# Altium project PCB_Project.PrjPcb
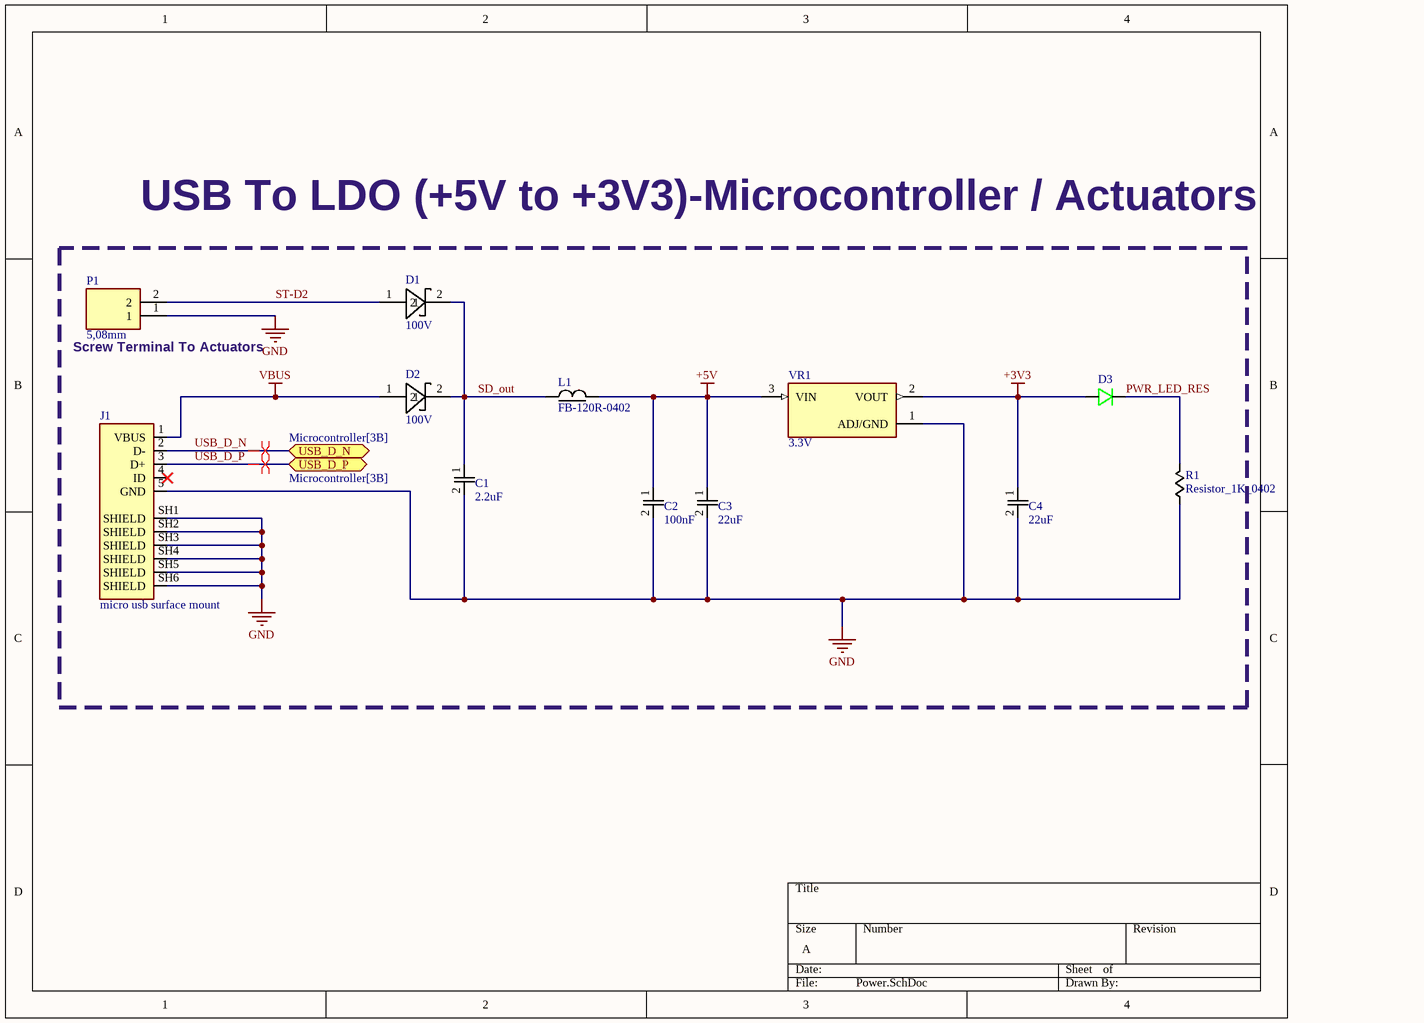
[diagram p0: Power.SchDoc]
4 sheets, 51 parts. Net scope: flat (ports and power ports of the same name join across sheets).
Board file: PCB1.PcbDoc
Sheets:
  Power.SchDoc
  Microcontroller.SchDoc
  Sensors.SchDoc
  Actuators.SchDoc

## Sheet Power.SchDoc
size A; SheetNumber: 1; SheetTotal: 4

### Parts
C1  2.2uF  [CAPC1005X55N]
C2  100nF  [CAPC1005X55N]
C3  22uF  [CAPC1005X55N]
C4  22uF  [CAPC1005X55N]
D1  100V  [Schottky.D]
D2  100V  [Schottky.D]
D3  Green LED 0805  [LED_APT2012MGC]  (value not drawn)
J1  micro usb surface mount  [TE_1981568-1]
L1  FB-120R-0402  [RESC1005X40N]
P1  5,08mm  [Screw_terminal_block_5.0]
R1  Resistor_1K_0402  [RESC1005X40N]
VR1  3.3V  [SOT229P700X180-4N]

### Blocks framed on the sheet
Screw Terminal To Actuators: C1-C4 D1-D3 J1 L1 P1 R1 VR1

### Ports
USB_D_N (bidir, see Microcontroller[3B]), USB_D_P (bidir, see Microcontroller[3B])

### Nets
+3V3: C4.1 D3.A VR1.2(VOUT)
+5V: C2.1 C3.1 L1.2 VR1.3(VIN)
GND: C1.2 C2.2 C3.2 C4.2 J1.5(GND) J1.SH1(SHIELD) J1.SH2(SHIELD) J1.SH3(SHIELD) J1.SH4(SHIELD) J1.SH5(SHIELD) J1.SH6(SHIELD) P1.1 R1.1 VR1.1(ADJ/GND)
VBUS: D2.1 J1.1(VBUS)
PWR_LED_RES: D3.C R1.2
SD_out: C1.1 D1.2 D2.2 L1.1
ST-D2: D1.1 P1.2
USB_D_N: J1.2(D-) ; port USB_D_N
USB_D_P: J1.3(D+) ; port USB_D_P

Not connected (* = marked no-connect by the designer): J1 4(ID)*

### Layout directives
differential pair: USB_D_N, USB_D_P

### Notes on the sheet
- USB To LDO (+5V to +3V3)-Microcontroller / Actuators

### Library data of the parts
C1 = Cap_2.2uF_0402: CAP CER 2.2uF 16V X5R 0402; Manufacturer: Samsung Electro-Mechanics; Manufacturer Part #: CL05A225KO5NQNC; Supplier: LCSC; Supplier Part#: C170151; ComponentLink1Description: Data Sheet; ComponentLink1URL: https://www.lcsc.com/datasheet/C170151.pdf?spm=wm.sxq.inf.ggs___wm.fly.bg.3.stp&lcsc_vid=T1MKV1cAE1gLBAVfTgIKUgJfTlkPBQBVQlMMBAJURwAxVlNeT1dfVlxVQ1ReXzsOAxUeFF5JWBYZEEoKFBINSQcJGk4%3D
C2 = Cap_100nF_0402: CAP CER 100nF 16V X7R 0402; Manufacturer: Samsung Electro-Mechanics; Manufacturer Part #: CL05B104KO5NNNC; Supplier: LCSC; Supplier Part#: C1525; ComponentLink1Description: Data Sheet; ComponentLink1URL: https://www.lcsc.com/datasheet/C1525.pdf?spm=wm.sxq.inf.ggs___wm.fly.bg.1.stp&lcsc_vid=T1MKV1cAE1gLBAVfTgIKUgJfTlkPBQBVQlMMBAJURwAxVlNeT1dfVlxVQ1ReXzsOAxUeFF5JWBYZEEoKFBINSQcJGk4%3D
C3 C4 = Cap_22uF_0402: CAP CER 22uF 6.3V X5R 0402; Manufacturer: Samsung Electro-Mechanics; Manufacturer Part #: CL05A226MQ5QUNC; Supplier: LCSC; Supplier Part#: C105226; ComponentLink1Description: Data Sheet; ComponentLink1URL: https://www.lcsc.com/datasheet/C105226.pdf?spm=wm.sxq.inf.ggs___wm.fly.bg.3.stp&lcsc_vid=T1MKV1cAE1gLBAVfTgIKUgJfTlkPBQBVQlMMBAJURwAxVlNeT1dfVlxVQ1ReXzsOAxUeFF5JWBYZEEoKFBINSQcJGk4%3D
D1 D2 = Schottky_D: 100V 850mV@5A 5A SMAG Schottky Diodes ROHS; Manufacturer: Nexperia; Mfr. Part #: BAT54S,215; Splr.part#: C466506; Supplier: LCSC; ComponentLink1Description: New link; ComponentLink1URL: https://www.lcsc.com/product-detail/C466506.html?s_z=n_schottky%2520diode
D3 = Green LED 0805: LED GREEN 0805 SMD; Manufacturer: NATIONSTAR; Manufacturer Part#: NCD0805G1; Supplier: LCSC; Supplier Part#: C84260; ComponentLink1Description: Data Sheet; ComponentLink1URL: https://www.lcsc.com/datasheet/C84260.pdf?spm=wm.sxq.inf.ggs___wm.fly.bg.0.stp&lcsc_vid=FVIKU1JeEVJYVVVSQVdZUQJSQlYKVAJXRwQLV1VXQlYxVlNeQVdfUV1TQ1ReXzsOAxUeFF5JWBYZEEoKFBINSQcJGk4NBhADEA4cHktXRlVcSQwSGg0%3D
J1 = micro usb surface mount: MICRO USB, TYPE B,; Manufacturer: HMTCONN; Manufacturer Part#: HMT-MICRO USB 4P; Supplier: LCSC; Supplier Part#: C53121381; ComponentLink1Description: Data Sheet; ComponentLink1URL: https://www.lcsc.com/datasheet/C53121381.pdf?spm=wm.sxq.inf.ggs___wm.ssy.bg.2.stp&lcsc_vid=RlgPBF0EEVEPX1ZVRAVZVwcHRVJaBVJSTlNXAgBWFlkxVlNeQFFbX1NTQ1dfVzsOAxUeFF5JWBYZEEoKFBINSQcJGk4eFQsCAgIaSgADAwAHC0slT1VdUFJIHxUDCw%3D%3D
L1 = FB-120R-0402: FERRITE BEAD 120Ω 0402; Manufacturer: KOHERelec; Manufacturer Part#: FBHA0402-121-202R; Supplier: LCSC; Supplier Part#: C41355350; ComponentLink1Description: Data Sheet; ComponentLink1URL: https://www.lcsc.com/datasheet/C41355350.pdf?spm=wm.sxq.inf.ggs___wm.fly.bg.5.stp&lcsc_vid=T1MKV1cAE1gLBAVfTgIKUgJfTlkPBQBVQlMMBAJURwAxVlNeT1dcVldXR1JYUjsOAxUeFF5JWBYZEEoKFBINSQcJGk4NBhADEA4cHktXRlZeSQwSGg0%3D
P1 = screw terminal block 2 port: 1x2P 18A -40℃~+105℃ 250V Green 14~30 Through Hole 5.08mm 2.5 1 2 Through Hole,P=5.08mm Screw Terminal Blocks ROHS; Manufacturer: KANGNEX; Mfr. Part #: WJ500V-5.08-2P; Splr.part#: C8465; Supplier: LCSC; ComponentLink1Description: New link; ComponentLink1URL: https://www.lcsc.com/product-detail/C8465.html
R1 = Resistor_1K_0402: 1kOhms Â±1% 0.063W, 1/16W Chip Resistor 0402 (1005 Metric) Moisture Resistant Thick Film; Manufacturer: FOJAN; Manufacturer Part #: RC0402FR-071KL; Supplier: LCSC; Supplier Part #: C106235; ComponentLink1Description: Data Sheet; ComponentLink1URL: https://www.lcsc.com/datasheet/C106235.pdf?spm=wm.sxq.inf.ggs___wm.fly.bg.2.stp&lcsc_vid=T1MKV1cAE1gLBAVfTgIKUgJfTlkPBQBVQlMMBAJURwAxVlNeT1dcVlJVRFlZVzsOAxUeFF5JWBYZEEoKFBINSQcJGk4NBhADEA4cHktXRlhXSQwSGg0%3D
VR1 = AMS1117_3.3: 72dB@(120Hz) 1A Fixed 3.3V Positive 16V SOT-223 Voltage Regulators - Linear, Low Drop Out (LDO) Regulators ROHS; Manufacturer: Advanced Monolithic Systems; Mfr. Part #: AMS1117-3.3; Splr.part#: C6186; Supplier: LCSC; ComponentLink1Description: New link; ComponentLink1URL: https://www.lcsc.com/product-detail/C6186.html?s_z=n_ASM1117

## Sheet Microcontroller.SchDoc
size 420 x 297 mm; SheetNumber: 2; SheetTotal: 4
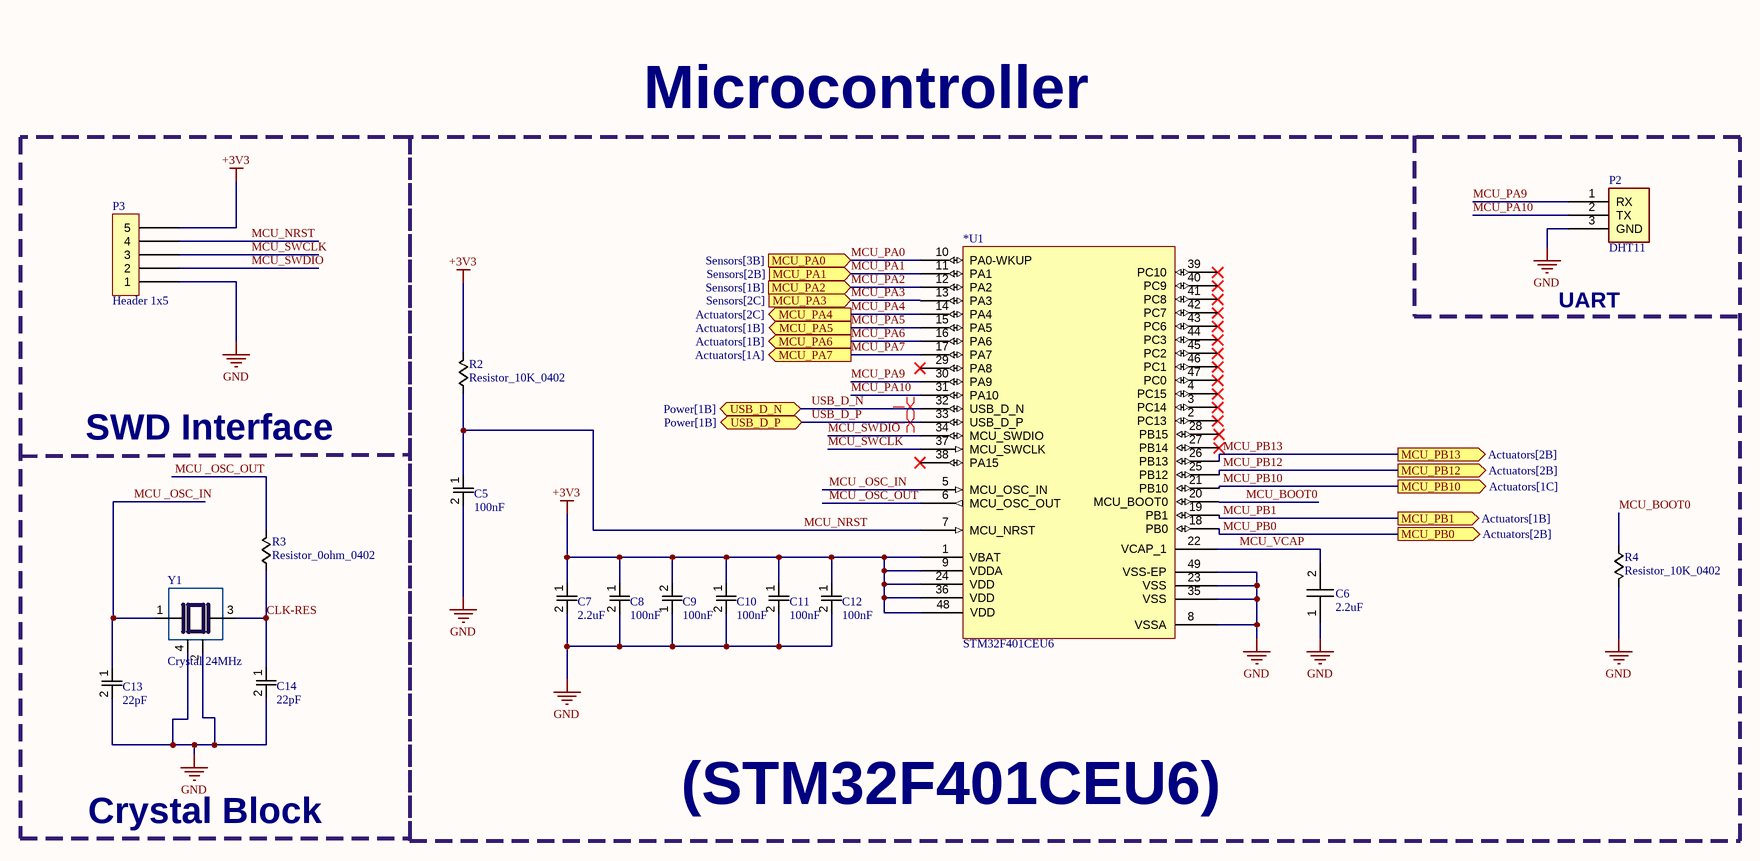
[diagram p1: Microcontroller.SchDoc]

### Parts
*U1  STM32F401CEU6  [UFQFPN-48_7x7mm_P0.5mm]
C5  100nF  [CAPC1005X55N]
C6  2.2uF  [CAPC2012X140N]
C7  2.2uF  [CAPC1005X55N]
C8  100nF  [CAPC1005X55N]
C9  100nF  [CAPC1005X55N]
C10  100nF  [CAPC1005X55N]
C11  100nF  [CAPC1005X55N]
C12  100nF  [CAPC1005X55N]
C13  22pF  [CAPC1005X55N]
C14  22pF  [CAPC1005X55N]
P2  DHT11  [HEADER 1x3 MALE]
P3  Header 1x5  [Header 1x5 male]
R2  Resistor_10K_0402  [RESC1005X40N]
R3  Resistor_0ohm_0402  [RESC1005X40N]
R4  Resistor_10K_0402  [RESC1005X40N]
Y1  Crystal 24MHz  [XTAL_C7S-24.000-12-3030-X-R]

### Blocks framed on the sheet
(STM32F401CEU6): *U1 C5-C12 P2 R2 R4

### Ports
MCU_PA0 (in, see Sensors[3B]), MCU_PA1 (in, see Sensors[2B]), MCU_PA2 (in, see Sensors[1B]), MCU_PA3 (in, see Sensors[2C]), MCU_PA4 (out, see Actuators[2C]), MCU_PA5 (out, see Actuators[1B]), MCU_PA6 (out, see Actuators[1B]), MCU_PA7 (out, see Actuators[1A]), MCU_PB0 (out, see Actuators[2B]), MCU_PB1 (out, see Actuators[1B]), MCU_PB10 (out, see Actuators[1C]), MCU_PB12 (out, see Actuators[2B]), MCU_PB13 (out, see Actuators[2B]), USB_D_N (bidir, see Power[1B]), USB_D_P (bidir, see Power[1B])

### Nets
+3V3: *U1.1(VBAT) *U1.9(VDDA) *U1.24(VDD) *U1.36(VDD) *U1.48(VDD) C7.1 C8.1 C9.2 C10.1 C11.1 C12.1 P3.5 R2.2
GND: *U1.8(VSSA) *U1.23(VSS) *U1.35(VSS) *U1.49(VSS-EP) C5.2 C6.1 C7.2 C8.2 C9.1 C10.2 C11.2 C12.2 C13.2 C14.2 P2.3(GND) P3.1 R4.2 Y1.2 Y1.4
CLK-RES: C14.1 R3.1 Y1.3
MCU _OSC_IN: *U1.5(MCU_OSC_IN) C13.1 Y1.1
MCU _OSC_OUT: *U1.6(MCU_OSC_OUT) R3.2
MCU_BOOT0: *U1.20(MCU_BOOT0) R4.1
MCU_NRST: *U1.7(MCU_NRST) C5.1 P3.4 R2.1
MCU_PA0: *U1.10(PA0-WKUP) ; port MCU_PA0
MCU_PA1: *U1.11(PA1) ; port MCU_PA1
MCU_PA2: *U1.12(PA2) ; port MCU_PA2
MCU_PA3: *U1.13(PA3) ; port MCU_PA3
MCU_PA4: *U1.14(PA4) ; port MCU_PA4
MCU_PA5: *U1.15(PA5) ; port MCU_PA5
MCU_PA6: *U1.16(PA6) ; port MCU_PA6
MCU_PA7: *U1.17(PA7) ; port MCU_PA7
MCU_PA9: *U1.30(PA9) P2.1(RX)
MCU_PA10: *U1.31(PA10) P2.2(TX)
MCU_PB0: *U1.18(PB0) ; port MCU_PB0
MCU_PB1: *U1.19(PB1) ; port MCU_PB1
MCU_PB10: *U1.21(PB10) ; port MCU_PB10
MCU_PB12: *U1.25(PB12) ; port MCU_PB12
MCU_PB13: *U1.26(PB13) ; port MCU_PB13
MCU_SWCLK: *U1.37(MCU_SWCLK) P3.3
MCU_SWDIO: *U1.34(MCU_SWDIO) P3.2
MCU_VCAP: *U1.22(VCAP_1) C6.2
USB_D_N: *U1.32(USB_D_N) ; port USB_D_N
USB_D_P: *U1.33(USB_D_P) ; port USB_D_P

Not connected (* = marked no-connect by the designer): *U1 2(PC13)* 3(PC14)* 4(PC15)* 27(PB14)* 28(PB15)* 29(PA8)* 38(PA15)* 39(PC10)* 40(PC9)* 41(PC8)* 42(PC7)* 43(PC6)* 44(PC3)* 45(PC2)* 46(PC1)* 47(PC0)*

### Layout directives
differential pair: (no net found under the mark), USB_D_P

### Notes on the sheet
- Microcontroller
- UART
- SWD Interface
- Crystal Block
- THIS DOCUMENT AND THE DATA DISCLOSED HEREIN OR
- HEREWITH IS THE PROPERTY OF ALTIUM LIMITED AND MAY
- DWG NO:
- REVISION
- REV:
- DESCRIPTION
- DATE
- APPROVED
- BE FREELY DISTRIBUTED IN WHOLE. NO RIGHTS ARE
- RESERVED OR EXPRESS OR IMPLIED WARANTEE GIVEN.
- ENG:
- APPROVALS
- PROJECT
- DSN:
- CHK:
- REFERENCE DOCUMENTS
- PROJECT REVISION:
- TITLE
- DOCUMENT REVISION:
- DESIGN ITEM:
- BOM:
- FAB DWG:
- PCB DWG:
- ASSY DWG:
- SCALE:
- A3
- SIZE
- CAGE CODE
- FILE NAME
- DWG NO.
- SHEET
- OF
- REV

### Library data of the parts
*U1 = STM32F401CEU6: ARM Cortex-M4 32b MCU+FPU,105DMIPS,512KB Flash/96KB RAM, 11 TIMs, 1 ADC, 11 comm. interfaces; Manufacturer: ST; Manufacturer Part#: STM32F401CEU6; Supplier: LCSC; Supplier Part#: C60420; ComponentLink1Description: Data Sheet; ComponentLink1URL: https://www.lcsc.com/datasheet/C60420.pdf?spm=wm.sxq.inf.ggs___wm.fly.bg.0.stp&lcsc_vid=E1QPAlFSFlQNAwEAEQJdBlJfE1hWVlFUQlIPUgAERAIxVlNeQFNcV1NSTlNaUDsOAxUeFF5JWBYZEEoKFBINSQcJGk4%3D
C5 C8-C12 = Cap_100nF_0402: as C2 on sheet Power; Supplier: LCSC; Supplier Part#: C1525; ComponentLink1Description: Data Sheet; ComponentLink1URL: https://www.lcsc.com/datasheet/C1525.pdf?spm=wm.sxq.inf.ggs___wm.fly.bg.1.stp&lcsc_vid=T1MKV1cAE1gLBAVfTgIKUgJfTlkPBQBVQlMMBAJURwAxVlNeT1dfVlxVQ1ReXzsOAxUeFF5JWBYZEEoKFBINSQcJGk4%3D
C6 = Cap_0805_2u2F: CAP CER 2.2uF 16V X7R 0805; Manufacturer: Samsung Electro-Mechanics; Manufacturer Part#: CL21B225KOFNNNE; Supplier: LCSC; Supplier Part#: C28234; ComponentLink1Description: Data Sheet; ComponentLink1URL: https://www.lcsc.com/datasheet/C28234.pdf?spm=wm.sxq.inf.ggs___wm.fly.bg.7.stp&lcsc_vid=RlgPBF0EEVEPX1ZVRAVZVwcHRVJaBVJSTlNXAgBWFlkxVlNeQFFbX1RVRFRaVTsOAxUeFF5JWBYZEEoBGA4JCwFIFA4DSA%3D%3D
C7 = Cap_2.2uF_0402: as C1 on sheet Power; Supplier: LCSC; Supplier Part#: C170151; ComponentLink1Description: Data Sheet; ComponentLink1URL: https://www.lcsc.com/datasheet/C170151.pdf?spm=wm.sxq.inf.ggs___wm.fly.bg.3.stp&lcsc_vid=T1MKV1cAE1gLBAVfTgIKUgJfTlkPBQBVQlMMBAJURwAxVlNeT1dfVlxVQ1ReXzsOAxUeFF5JWBYZEEoKFBINSQcJGk4%3D
C13 C14 = Cap_22pF_0402: CAP CER 22pF 50V NP0 0402; Manufacturer: YAGEO; Manufacturer Part #: CC0402JRNPO9BN220; Supplier: LCSC; Supplier Part#: C106203; ComponentLink1Description: Data Sheet; ComponentLink1URL: https://www.lcsc.com/datasheet/C106203.pdf?spm=wm.sxq.inf.ggs___wm.fly.bg.0.stp&lcsc_vid=RFgKVFNTRgJeV1xfTlldBAVTQANbU1dQTgBXBVEDElgxVlNeT1ZZU1VQQ1ZZXztW
P2 = UART: ComponentLink1Description: Link
R2 R4 = Resistor_10K_0402: RES 10kΩ ±1% 62.5mW 0402; Manufacturer: YAGEO; Manufacturer Part #: RC0402FR-0710KL; Supplier: LCSC; Supplier Part #: C60490; ComponentLink1Description: Data Sheet; ComponentLink1URL: https://www.lcsc.com/datasheet/C60490.pdf?spm=wm.sxq.inf.ggs___wm.fly.bg.1.stp&lcsc_vid=T1MKV1cAE1gLBAVfTgIKUgJfTlkPBQBVQlMMBAJURwAxVlNeT1dcVVBSRVlfUDsOAxUeFF5JWBYZEEoKFBINSQcJGk4NBhADEA4cHktXRlhXSQwSGg0%3D
R3 = Resistor_0ohm_0402: RES 0Ω 0.1W 0402; Manufacturer: PANASONIC; Manufacturer Part #: ERJ2GE0R00X; Supplier: LCSC; Supplier Part #: C242160; ComponentLink1Description: Data Sheet; ComponentLink1URL: https://www.lcsc.com/datasheet/C242160.pdf?spm=wm.sxq.inf.ggs___wm.fly.bg.1.stp&lcsc_vid=T1MKV1cAE1gLBAVfTgIKUgJfTlkPBQBVQlMMBAJURwAxVlNeT1dcVF1TR1RYVzsOAxUeFF5JWBYZEEoKFBINSQcJGk4NBhADEA4cHktXRlhXSQwSGg0%3D
Y1 = Crystal 24MHz: YXC Crystal Oscillators XL7EL89CKI-111YLC-24M; Manufacturer Part#: SMD2016-4P; Manufacturer: YXC Crystal Oscillators; Supplier: LCSC; Supplier Part#: C2965580; ComponentLink1Description: Data Sheet; ComponentLink1URL: https://www.lcsc.com/datasheet/C2965580.pdf?spm=wm.sxq.inf.ggs___wm.fly.bg.0.stp&lcsc_vid=EVYPBVRQTlZbUwYCRFgKAVAHE1INAl1VRwJdBFRRElcxVlNeQFNdUFxSTldXXjsOAxUeFF5JWBYZEEoKFBINSQcJGk4dAgUUFAk%3D

## Sheet Sensors.SchDoc
size A; SheetNumber: 3; SheetTotal: 4
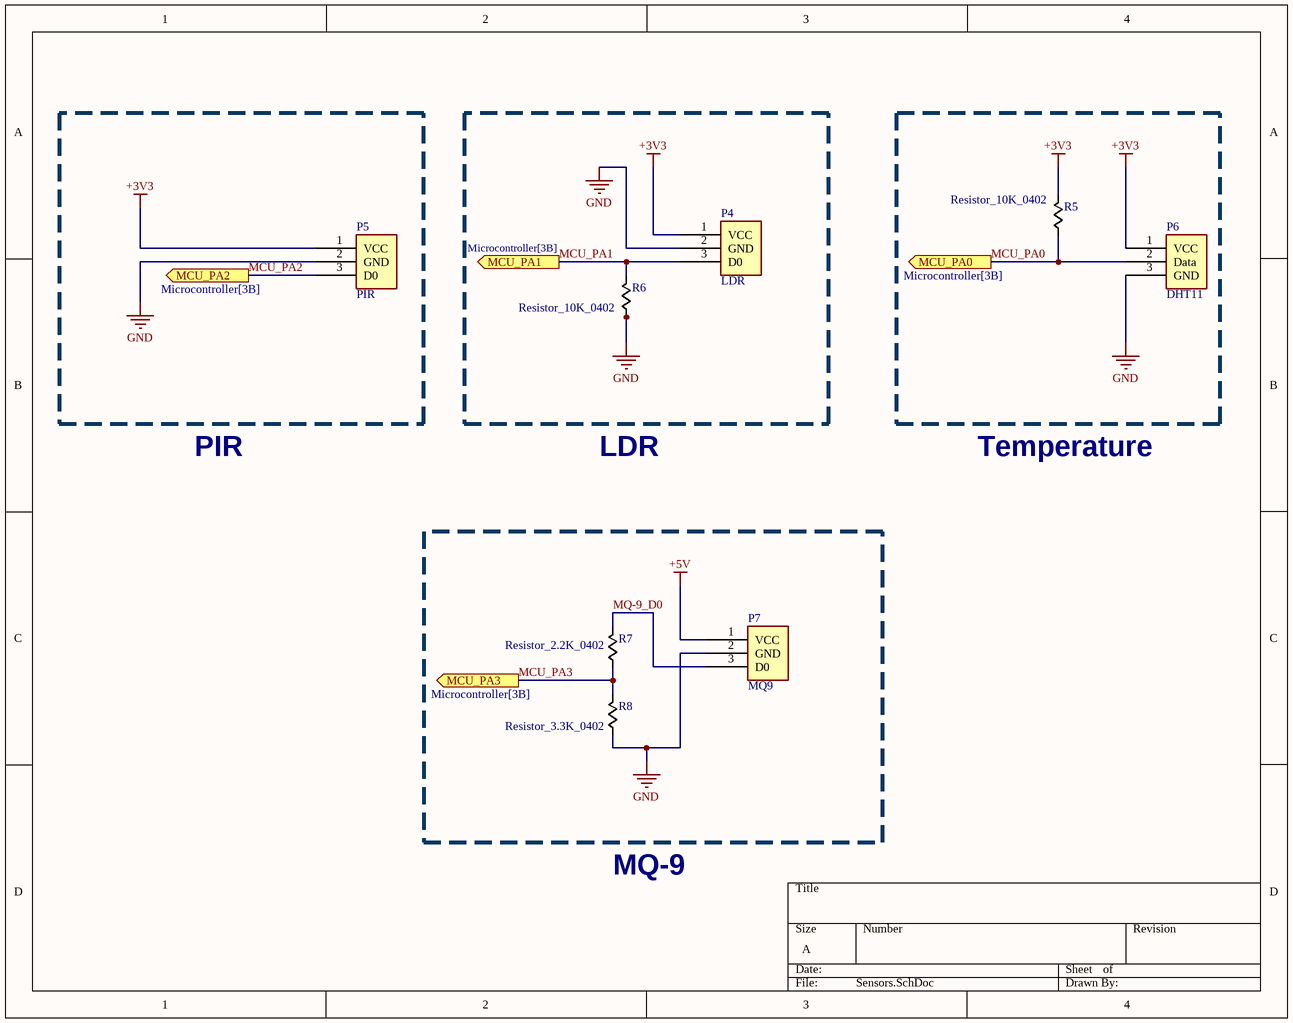
[diagram p2: Sensors.SchDoc]

### Parts
P4  LDR  [HEADER 1x3 MALE]
P5  PIR  [HEADER 1x3 MALE]
P6  DHT11  [HEADER 1x3 MALE]
P7  MQ9  [HEADER 1x3 MALE]
R5  Resistor_10K_0402  [RESC1005X40N]
R6  Resistor_10K_0402  [RESC1005X40N]
R7  Resistor_2.2K_0402  [RESC1005X40N]
R8  Resistor_3.3K_0402  [RESC1005X40N]

### Ports
MCU_PA0 (out, see Microcontroller[3B]), MCU_PA1 (out, see Microcontroller[3B]), MCU_PA2 (out, see Microcontroller[3B]), MCU_PA3 (out, see Microcontroller[3B])

### Nets
+3V3: P4.1(VCC) P5.1(VCC) P6.1(VCC) R5.2
+5V: P7.1(VCC)
GND: P4.2(GND) P5.2(GND) P6.3(GND) P7.2(GND) R6.1 R8.1
MCU_PA0: P6.2(Data) R5.1 ; port MCU_PA0
MCU_PA1: P4.3(D0) R6.2 ; port MCU_PA1
MCU_PA2: P5.3(D0) ; port MCU_PA2
MCU_PA3: R7.1 R8.2 ; port MCU_PA3
MQ-9_D0: P7.3(D0) R7.2

### Notes on the sheet
- PIR
- LDR
- Temperature
- MQ-9

### Library data of the parts
P4 = Header 1x3-LDR: The LDR Light Sensor Module detects light intensity, with resistance decreasing as light increases. Ideal for automatic lighting and brightness sensing.; Supplier: Makers Electronics; Supplier Part#: 300000009413; ComponentLink1Description: Link; ComponentLink1URL: https://makerselectronics.com/product/ldr-light-sensor-module/
P5 = Header 1x3-PIR: AM312  is a compact PIR motion sensor (HW-740) that detects motion up to 5 m with ultra-low power consumption for battery-powered projects.automatic lighting and brightness sensing.; Supplier: Makers Electronics; Supplier Part#: 3496300110674; ComponentLink1Description: Link; ComponentLink1URL: https://makerselectronics.com/product/am312-mini-pir-motion-sensor-module/
P6 = Header 1x3-DHT Temp: DHT11 Temperature Humidity Sensor Board measures temperature (0–50°C) and humidity (20–90%) with digital output, ideal for weather monitoring, IoT, automation.; Supplier: Makers Electronics; Supplier Part#: 300000009298; ComponentLink1Description: Link; ComponentLink1URL: https://makerselectronics.com/product/dht11-board/
P7 = Header 1x3-MQ9: MQ-9 is a compact and versatile gas sensor module for detecting carbon monoxide and combustible gases.; Supplier: Makers Electronics; Supplier Part#: 300000009267; ComponentLink1Description: Link; ComponentLink1URL: https://makerselectronics.com/product/mq-9-carbon-monoxide-gas-sensor/
R5 R6 = Resistor_10K_0402: as R2 on sheet Microcontroller; Supplier: LCSC; Supplier Part #: C60490; ComponentLink1Description: Data Sheet; ComponentLink1URL: https://www.lcsc.com/datasheet/C60490.pdf?spm=wm.sxq.inf.ggs___wm.fly.bg.1.stp&lcsc_vid=T1MKV1cAE1gLBAVfTgIKUgJfTlkPBQBVQlMMBAJURwAxVlNeT1dcVVBSRVlfUDsOAxUeFF5JWBYZEEoKFBINSQcJGk4NBhADEA4cHktXRlhXSQwSGg0%3D
R7 = Resistor_2.2K_0402: 2.2kOhms Â±1% 0.063W, 1/16W Chip Resistor 0402 (1005 Metric) Moisture Resistant Thick Film; Manufacturer: FOJAN; Manufacturer Part #: RC0402FR-071KL; Supplier: LCSC; Supplier Part #: C106235; ComponentLink1Description: Data Sheet; ComponentLink1URL: https://www.lcsc.com/datasheet/C106235.pdf?spm=wm.sxq.inf.ggs___wm.fly.bg.2.stp&lcsc_vid=T1MKV1cAE1gLBAVfTgIKUgJfTlkPBQBVQlMMBAJURwAxVlNeT1dcVlJVRFlZVzsOAxUeFF5JWBYZEEoKFBINSQcJGk4NBhADEA4cHktXRlhXSQwSGg0%3D
R8 = Resistor_3.3K_0402: RES 3.3kΩ ±1% 62.5mW 0402; Manufacturer: YAGEO; Manufacturer Part #: RC0402FR-074K7L; Supplier: LCSC; Supplier Part #: C105871; ComponentLink1Description: Data Sheet; ComponentLink1URL: https://www.lcsc.com/datasheet/C105871.pdf?spm=wm.sxq.inf.ggs___wm.fly.bg.0.stp&lcsc_vid=RFcPU1ZSEVdeBFReRgUKAgZXQAMKBQJURFUIAwVSQVgxVlNeT1dXUFZUTldcVjsOAxUeFF5JWBYZEEoKFBINSQcJGk4NBhADEA4cHktXR1BYSQwSGg0%3D

## Sheet Actuators.SchDoc
size A; SheetNumber: 4; SheetTotal: 4
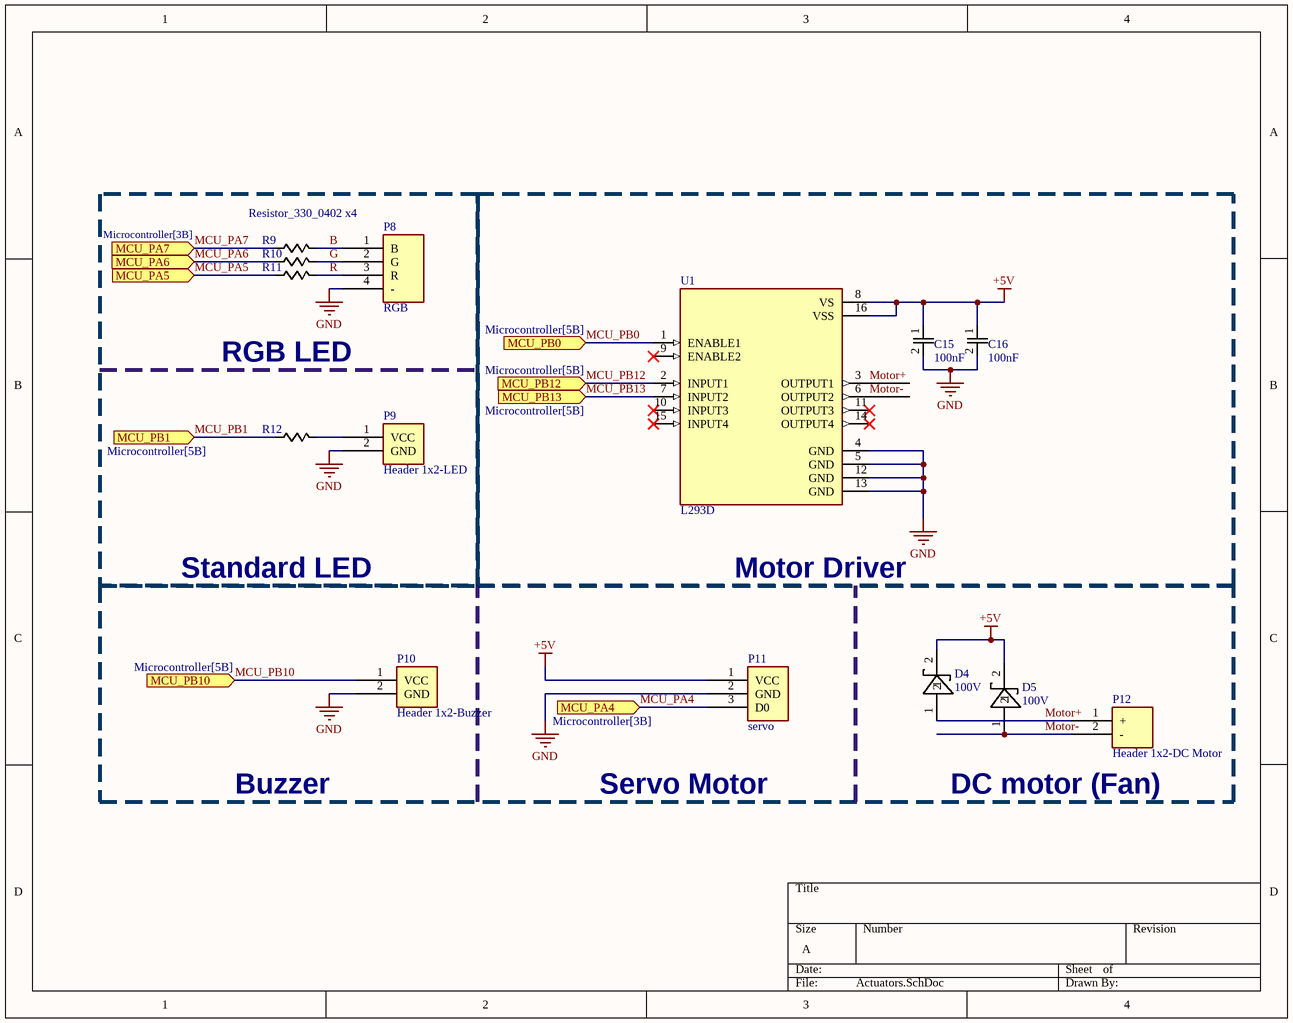
[diagram p3: Actuators.SchDoc]

### Parts
C15  100nF  [CAPC1005X55N]
C16  100nF  [CAPC1005X55N]
D4  100V  [Schottky.D]
D5  100V  [Schottky.D]
P8  RGB  [Header 1x4 male]
P9  Header 1x2-LED  [Header 1x2]
P10  Header 1x2-Buzzer  [Header 1x2]
P11  servo  [HEADER 1x3 MALE]
P12  Header 1x2-DC Motor  [Header 1x2]
R9  Resistor_330_0402 x4  [RESC1005X40N]
R10  Resistor_330_0402  [RESC1005X40N]  (value not drawn)
R11  Resistor_330_0402  [RESC1005X40N]  (value not drawn)
R12  Resistor_330_0402  [RESC1005X40N]  (value not drawn)
U1  L293D  [DIP880W50P254L2000H510Q16]

### Blocks framed on the sheet
Motor Driver: C15 C16 U1

### Ports
MCU_PA4 (in, see Microcontroller[3B]), MCU_PA5 (in, see Microcontroller[3B]), MCU_PA6 (in, see Microcontroller[3B]), MCU_PA7 (in, see Microcontroller[3B]), MCU_PB0 (in, see Microcontroller[5B]), MCU_PB1 (in, see Microcontroller[5B]), MCU_PB10 (in, see Microcontroller[5B]), MCU_PB12 (in, see Microcontroller[5B]), MCU_PB13 (in, see Microcontroller[5B])

### Nets
+5V: C15.1 C16.1 D4.2 D5.2 P11.1(VCC) U1.8(VS) U1.16(VSS)
GND: C15.2 C16.2 P8.4(-) P9.2(GND) P10.2(GND) P11.2(GND) U1.4(GND) U1.5(GND) U1.12(GND) U1.13(GND)
B: P8.1(B) R9.2
G: P8.2(G) R10.2
MCU_PA4: P11.3(D0) ; port MCU_PA4
MCU_PA5: R11.1 ; port MCU_PA5
MCU_PA6: R10.1 ; port MCU_PA6
MCU_PA7: R9.1 ; port MCU_PA7
MCU_PB0: U1.1(ENABLE1) ; port MCU_PB0
MCU_PB1: R12.1 ; port MCU_PB1
MCU_PB10: P10.1(VCC) ; port MCU_PB10
MCU_PB12: U1.2(INPUT1) ; port MCU_PB12
MCU_PB13: U1.7(INPUT2) ; port MCU_PB13
Motor+: D4.1 P12.1(+) U1.3(OUTPUT1)
Motor-: D5.1 P12.2(-) U1.6(OUTPUT2)
R: P8.3(R) R11.2
NetP9_1: P9.1(VCC) R12.2

Not connected (* = marked no-connect by the designer): U1 9(ENABLE2)* 10(INPUT3)* 11(OUTPUT3)* 14(OUTPUT4)* 15(INPUT4)*

### Notes on the sheet
- RGB LED
- Standard LED
- Buzzer
- Servo Motor
- (near P12) DC motor (Fan)

### Library data of the parts
C15 C16 = Cap_100nF_0402: as C2 on sheet Power; Supplier: LCSC; Supplier Part#: C1525; ComponentLink1Description: Data Sheet; ComponentLink1URL: https://www.lcsc.com/datasheet/C1525.pdf?spm=wm.sxq.inf.ggs___wm.fly.bg.1.stp&lcsc_vid=T1MKV1cAE1gLBAVfTgIKUgJfTlkPBQBVQlMMBAJURwAxVlNeT1dfVlxVQ1ReXzsOAxUeFF5JWBYZEEoKFBINSQcJGk4%3D
D4 D5 = Schottky_D: as D1 on sheet Power; Supplier: LCSC; ComponentLink1Description: New link; ComponentLink1URL: https://www.lcsc.com/product-detail/C466506.html?s_z=n_schottky%2520diode
P8 = Header 1x4-RGB_LED: HW-479 is a versatile RGB LED module with PWM control for vibrant color mixing, ideal for Arduino and microcontroller projects.; Supplier: Makers Electronics; Supplier Part#: 5597455270331; ComponentLink1Description: Link; ComponentLink1URL: https://makerselectronics.com/product/hw-479-rgb-led-module/
P9 = Header 1x2-LED: Round Transparent LED 3mm 2Pin available in blue and red colors is Bright and efficient, ideal for indicators, DIY electronics, and display applications.; Supplier: Makers Electronics; ComponentLink1Description: Link; ComponentLink1URL: https://makerselectronics.com/product/round-transparent-led-3mm-2pin/
P10 = Header 1x2-Buzzer: SFM-20B Piezo Buzzer Alarm 3-24VDC 95dB 23x12mm is a compact, active piezoelectric alarm buzzer for continuous audible alerts in low‑voltage DC systems.; Supplier: Makers Electronics; Supplier Part#: 3496300135059; ComponentLink1Description: Link; ComponentLink1URL: https://makerselectronics.com/product/sfm-20b-piezo-buzzer-alarm-3-24vdc-95db-23x12mm/
P11 = Header 1x3-Servo: servo-180-degree/; Supplier: Makers Electronics; Supplier Part#: 300000009139; ComponentLink1Description: Link; ComponentLink1URL: https://makerselectronics.com/product/sg90-micro-servo-180-degree/
P12 = Header 1x2-DC Motor: Compact OSEPP LS-00027 R280 brushed DC motor. Features 3-6V operation and a 2mm shaft. Ideal for robotics, DIY hobbies, and educational science projects.; Supplier: Makers Electronics; Supplier Part#: 667510001714; ComponentLink1Description: Link; ComponentLink1URL: https://makerselectronics.com/product/osepp-12000-rpm-dc-motor/
R9-R12 = Resistor_330_0402: RES 330Ω ±1% 62.5mW 0402; Manufacturer: YAGEO; Manufacturer Part #: RC0402FR-07330RL; Supplier: LCSC; Supplier Part #: C105875; ComponentLink1Description: Data Sheet; ComponentLink1URL: https://www.lcsc.com/datasheet/C105875.pdf?spm=wm.sxq.inf.ggs___wm.fly.bg.0.stp&lcsc_vid=RFcPU1ZSEVdeBFReRgUKAgZXQAMKBQJURFUIAwVSQVgxVlNeT1dXUFZUTldcVjsOAxUeFF5JWBYZEEoKFBINSQcJGk4NBhADEA4cHktXR1BYSQwSGg0%3D
U1 = L293D: Bipolar Motor Driver - Parallel 16-PowerDIP; Manufacturer: ST; Manufacturer Part#: L293D; Supplier: LCSC; Supplier Part#: C12340; ComponentLink1Description: Data Sheet; ComponentLink1URL: https://www.lcsc.com/datasheet/C12340.pdf?spm=wm.sxq.inf.ggs___wm.fly.bg.0.stp&lcsc_vid=QldaXwVWQ1ALVwBSRFNdXlZQFAAIVQZWQQAMUgIAQVkxVlNeT1dWUFZSRlFfVjsOAxUeFF5JWBYZEEoKFBINSQcJGk4%3D

## Nets that join several sheets
+3V3: Power (C4.1 D3.A VR1.2), Microcontroller (13 pins), Sensors (P4.1 P5.1 P6.1 R5.2)
+5V: Power (C2.1 C3.1 L1.2 VR1.3), Sensors (P7.1), Actuators (7 pins)
GND: Power (14 pins), Microcontroller (19 pins), Sensors (6 pins), Actuators (10 pins)
MCU_PA0: Microcontroller (*U1.10), Sensors (P6.2 R5.1)
MCU_PA1: Microcontroller (*U1.11), Sensors (P4.3 R6.2)
MCU_PA2: Microcontroller (*U1.12), Sensors (P5.3)
MCU_PA3: Microcontroller (*U1.13), Sensors (R7.1 R8.2)
MCU_PA4: Microcontroller (*U1.14), Actuators (P11.3)
MCU_PA5: Microcontroller (*U1.15), Actuators (R11.1)
MCU_PA6: Microcontroller (*U1.16), Actuators (R10.1)
MCU_PA7: Microcontroller (*U1.17), Actuators (R9.1)
MCU_PB0: Microcontroller (*U1.18), Actuators (U1.1)
MCU_PB1: Microcontroller (*U1.19), Actuators (R12.1)
MCU_PB10: Microcontroller (*U1.21), Actuators (P10.1)
MCU_PB12: Microcontroller (*U1.25), Actuators (U1.2)
MCU_PB13: Microcontroller (*U1.26), Actuators (U1.7)
USB_D_N: Power (J1.2), Microcontroller (*U1.32)
USB_D_P: Power (J1.3), Microcontroller (*U1.33)